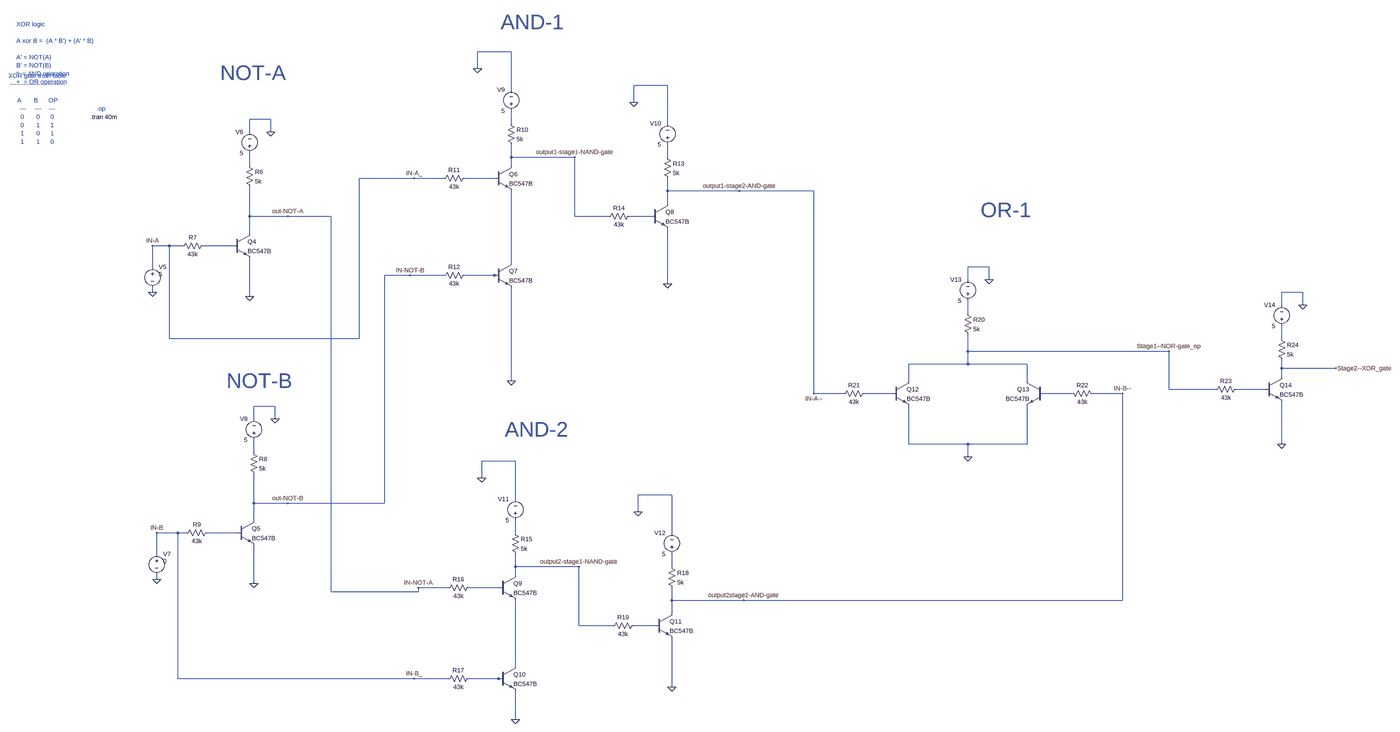
[diagram p0: schematic BJT_as_XOR_gate.asc, whole sheet]
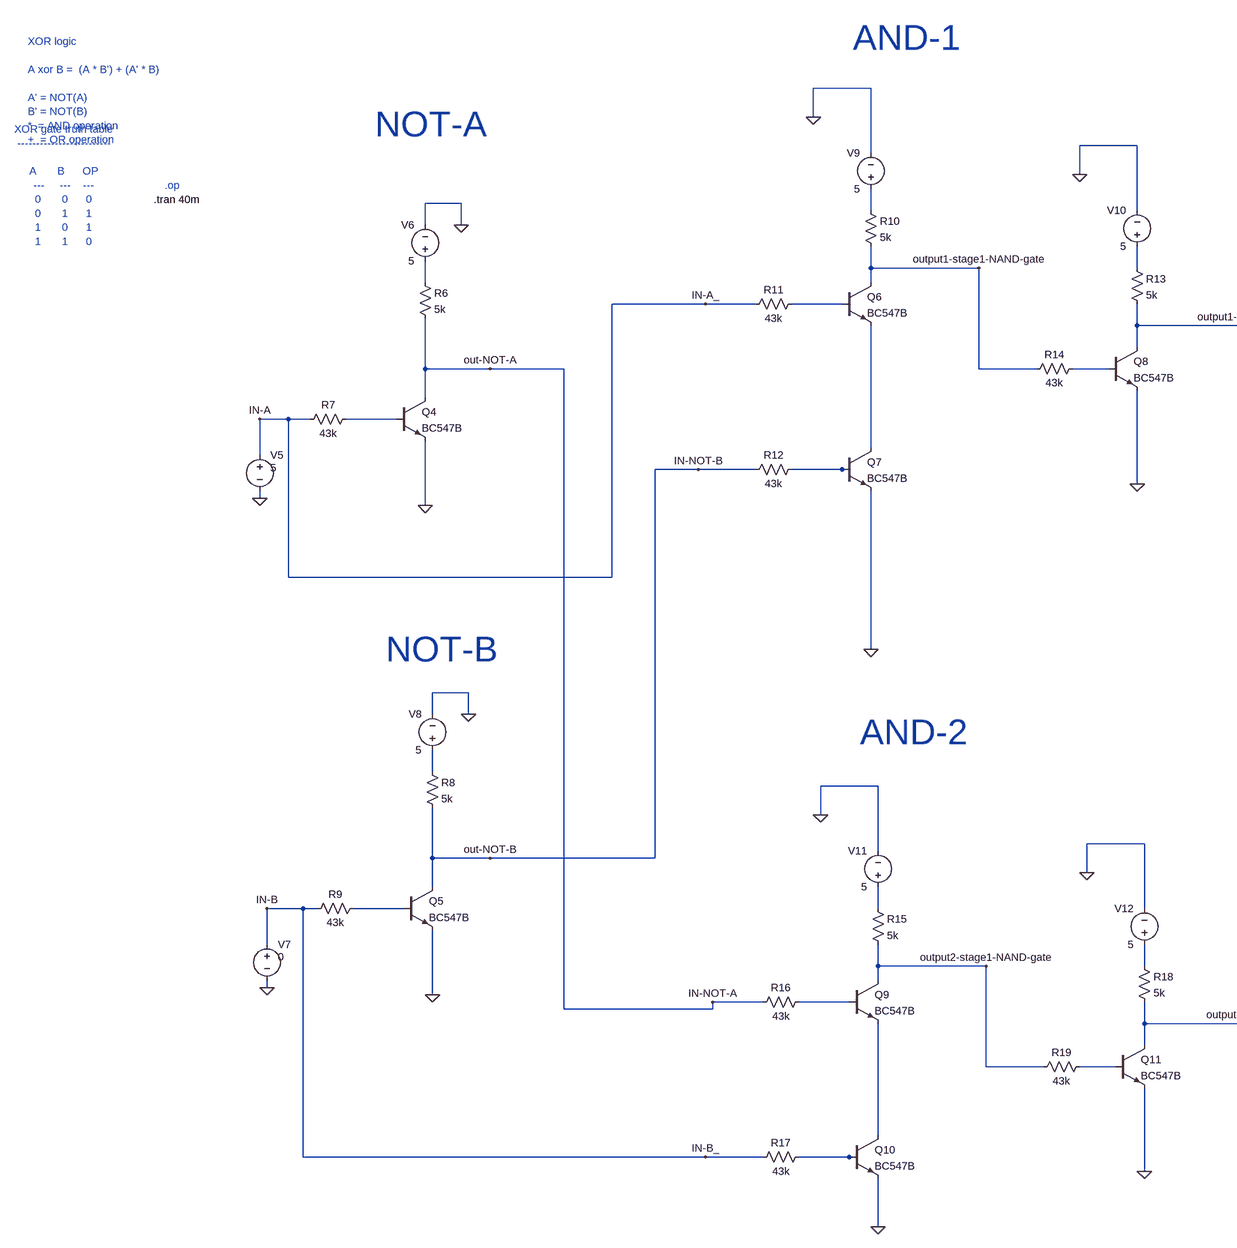
[diagram p1: schematic BJT_as_XOR_gate.asc, part, row 1 of 1, column 1 of 2]
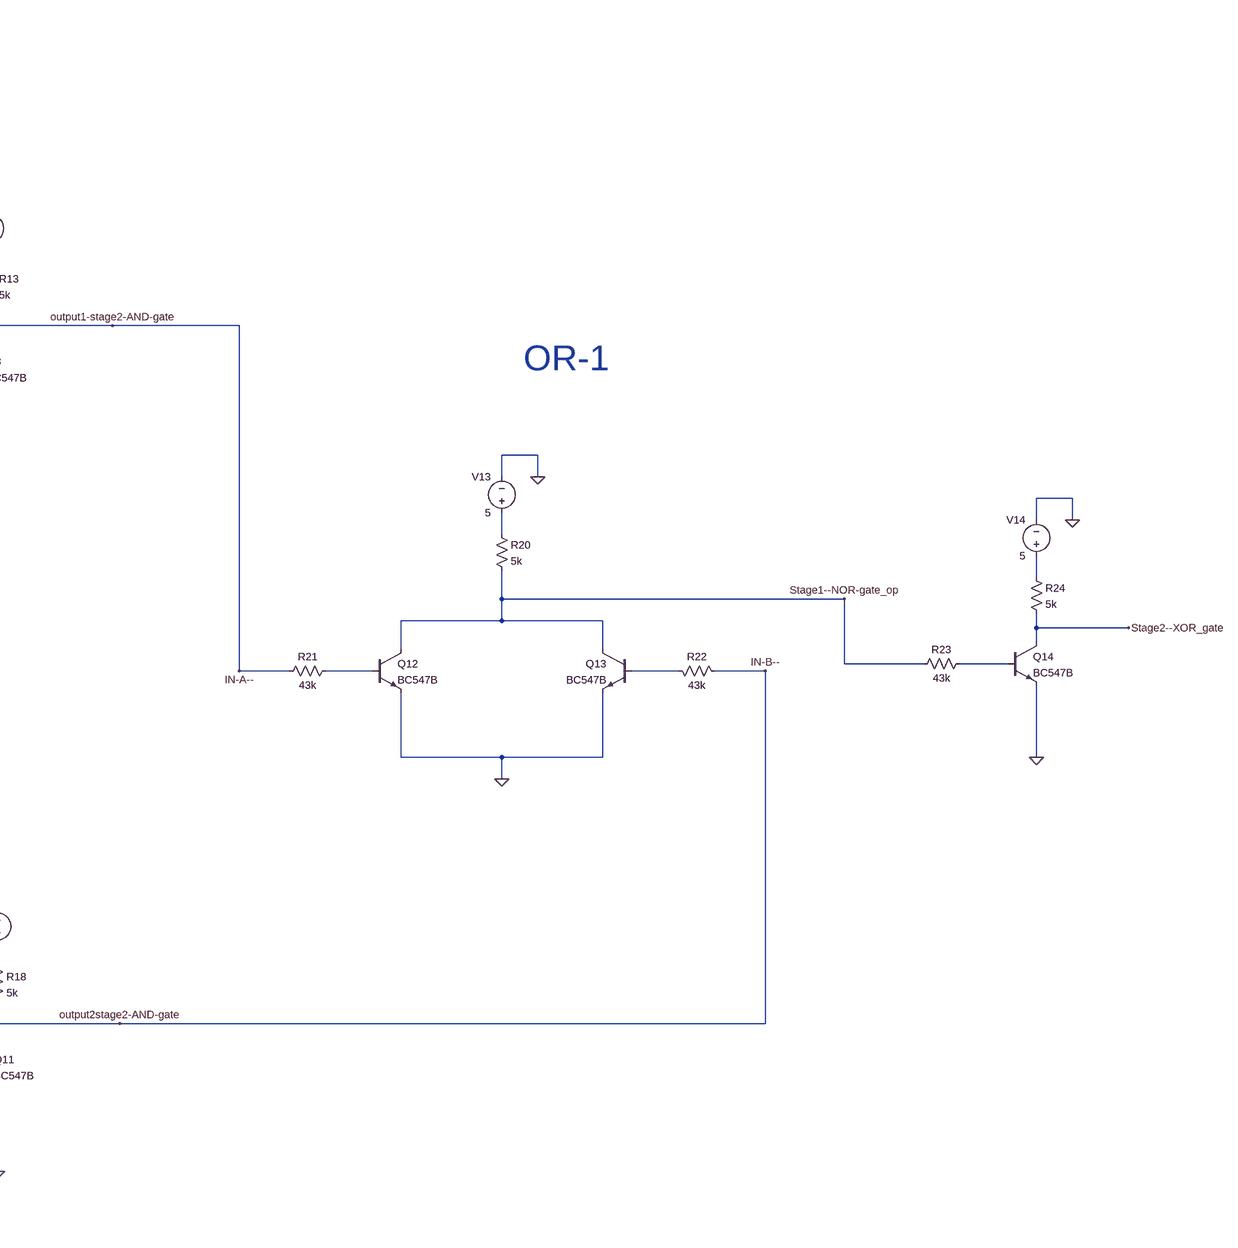
[diagram p2: schematic BJT_as_XOR_gate.asc, part, row 1 of 1, column 2 of 2]
BJT_as_XOR_gate.asc, the LTspice schematic file:
Version 4.1
SHEET 1 2536 1052
WIRE -1856 -3168 -1984 -3168
WIRE -1984 -3104 -1984 -3168
WIRE -1264 -3040 -1392 -3040
WIRE -1856 -3024 -1856 -3168
WIRE -1392 -2976 -1392 -3040
WIRE -3120 -2912 -3200 -2912
WIRE -1856 -2896 -1856 -2944
WIRE -1264 -2896 -1264 -3040
WIRE -3200 -2864 -3200 -2912
WIRE -3120 -2864 -3120 -2912
WIRE -1856 -2768 -1856 -2816
WIRE -1616 -2768 -1856 -2768
WIRE -1264 -2768 -1264 -2816
WIRE -3200 -2736 -3200 -2784
WIRE -1856 -2736 -1856 -2768
WIRE -2224 -2688 -2432 -2688
WIRE -2112 -2688 -2224 -2688
WIRE -1920 -2688 -2032 -2688
WIRE -1264 -2640 -1264 -2688
WIRE -992 -2640 -1264 -2640
WIRE -352 -2640 -992 -2640
WIRE -1264 -2592 -1264 -2640
WIRE -3200 -2544 -3200 -2656
WIRE -3056 -2544 -3200 -2544
WIRE -2592 -2544 -3056 -2544
WIRE -1616 -2544 -1616 -2768
WIRE -1488 -2544 -1616 -2544
WIRE -1328 -2544 -1408 -2544
WIRE -3200 -2480 -3200 -2544
WIRE -3504 -2432 -3568 -2432
WIRE -3456 -2432 -3504 -2432
WIRE -3264 -2432 -3376 -2432
WIRE -1856 -2368 -1856 -2640
WIRE -3568 -2352 -3568 -2432
WIRE 320 -2352 240 -2352
WIRE -2240 -2320 -2336 -2320
WIRE -2112 -2320 -2240 -2320
WIRE -1920 -2320 -2032 -2320
WIRE -1904 -2320 -1920 -2320
WIRE 240 -2304 240 -2352
WIRE 320 -2304 320 -2352
WIRE -1264 -2288 -1264 -2496
WIRE -3568 -2256 -3568 -2272
WIRE 1520 -2256 1440 -2256
WIRE -3200 -2240 -3200 -2384
WIRE 1440 -2208 1440 -2256
WIRE 1520 -2208 1520 -2256
WIRE 240 -2176 240 -2224
WIRE -3504 -2080 -3504 -2432
WIRE -2432 -2080 -2432 -2688
WIRE -2432 -2080 -3504 -2080
WIRE 1440 -2080 1440 -2128
WIRE 240 -2032 240 -2096
WIRE 1008 -2032 240 -2032
WIRE 240 -1984 240 -2032
WIRE 240 -1984 16 -1984
WIRE 464 -1984 240 -1984
WIRE 1440 -1968 1440 -2000
WIRE 1776 -1968 1440 -1968
WIRE 1440 -1936 1440 -1968
WIRE -1856 -1920 -1856 -2272
WIRE 16 -1920 16 -1984
WIRE 464 -1920 464 -1984
WIRE 1008 -1888 1008 -2032
WIRE 1184 -1888 1008 -1888
WIRE 1376 -1888 1264 -1888
WIRE -352 -1872 -352 -2640
WIRE -240 -1872 -352 -1872
WIRE -48 -1872 -160 -1872
WIRE 640 -1872 528 -1872
WIRE 832 -1872 720 -1872
WIRE -3104 -1824 -3184 -1824
WIRE -3184 -1776 -3184 -1824
WIRE -3104 -1776 -3104 -1824
WIRE 16 -1680 16 -1824
WIRE 240 -1680 16 -1680
WIRE 464 -1680 464 -1824
WIRE 464 -1680 240 -1680
WIRE 1440 -1680 1440 -1840
WIRE -3184 -1648 -3184 -1696
WIRE 240 -1632 240 -1680
WIRE -1840 -1616 -1968 -1616
WIRE -1968 -1552 -1968 -1616
WIRE -1248 -1488 -1376 -1488
WIRE -1840 -1472 -1840 -1616
WIRE -3184 -1456 -3184 -1568
WIRE -3056 -1456 -3184 -1456
WIRE -2336 -1456 -2336 -2320
WIRE -2336 -1456 -3056 -1456
WIRE -1376 -1424 -1376 -1488
WIRE -3184 -1392 -3184 -1456
WIRE -3472 -1344 -3552 -1344
WIRE -3440 -1344 -3472 -1344
WIRE -3248 -1344 -3360 -1344
WIRE -1840 -1344 -1840 -1392
WIRE -1248 -1344 -1248 -1488
WIRE -3552 -1264 -3552 -1344
WIRE -1840 -1216 -1840 -1264
WIRE -1600 -1216 -1840 -1216
WIRE -1248 -1216 -1248 -1264
WIRE -1840 -1184 -1840 -1216
WIRE -3552 -1168 -3552 -1184
WIRE -3184 -1152 -3184 -1296
WIRE -2096 -1136 -2208 -1136
WIRE -1904 -1136 -2016 -1136
WIRE -2592 -1120 -2592 -2544
WIRE -2208 -1120 -2208 -1136
WIRE -2208 -1120 -2592 -1120
WIRE -1248 -1088 -1248 -1136
WIRE -976 -1088 -1248 -1088
WIRE 832 -1088 832 -1872
WIRE 832 -1088 -976 -1088
WIRE -1248 -1040 -1248 -1088
WIRE -1600 -992 -1600 -1216
WIRE -1472 -992 -1600 -992
WIRE -1312 -992 -1392 -992
WIRE -1840 -816 -1840 -1088
WIRE -3472 -768 -3472 -1344
WIRE -2224 -768 -3472 -768
WIRE -2096 -768 -2224 -768
WIRE -1904 -768 -2016 -768
WIRE -1888 -768 -1904 -768
WIRE -1248 -736 -1248 -944
WIRE -1840 -368 -1840 -720
FLAG -3568 -2432 IN-A
FLAG -3568 -2256 0
FLAG -3120 -2864 0
FLAG -3200 -2240 0
FLAG -3552 -1344 IN-B
FLAG -3552 -1168 0
FLAG -3104 -1776 0
FLAG -3184 -1152 0
FLAG -3056 -2544 out-NOT-A
FLAG -3056 -1456 out-NOT-B
FLAG -2224 -2688 IN-A_
FLAG -2240 -2320 IN-NOT-B
FLAG -1856 -1920 0
FLAG -1984 -3104 0
FLAG -1392 -2976 0
FLAG -1264 -2288 0
FLAG -1616 -2768 output1-stage1-NAND-gate
FLAG -992 -2640 output1-stage2-AND-gate
FLAG -2208 -1136 IN-NOT-A
FLAG -2224 -768 IN-B_
FLAG -1840 -368 0
FLAG -1968 -1552 0
FLAG -1376 -1424 0
FLAG -1248 -736 0
FLAG -1600 -1216 output2-stage1-NAND-gate
FLAG -976 -1088 output2stage2-AND-gate
FLAG -352 -1872 IN-A--
FLAG 832 -1872 IN-B--
FLAG 240 -1632 0
FLAG 320 -2304 0
FLAG 1008 -2032 Stage1--NOR-gate_op
FLAG 1520 -2208 0
FLAG 1440 -1680 0
FLAG 1776 -1968 Stage2--XOR_gate
SYMBOL voltage -3568 -2368 R0
WINDOW 3 24 44 Left 2
WINDOW 123 0 0 Left 0
WINDOW 39 0 0 Left 0
SYMATTR Value 5
SYMATTR InstName V5
SYMBOL npn -3264 -2480 R0
SYMATTR InstName Q4
SYMATTR Value BC547B
SYMBOL voltage -3200 -2768 R180
WINDOW 0 24 96 Left 2
WINDOW 3 24 16 Left 2
WINDOW 123 0 0 Left 0
WINDOW 39 0 0 Left 0
SYMATTR InstName V6
SYMATTR Value 5
SYMBOL res -3216 -2752 R0
SYMATTR InstName R6
SYMATTR Value 5k
SYMBOL res -3360 -2448 R90
WINDOW 0 0 56 VBottom 2
WINDOW 3 32 56 VTop 2
SYMATTR InstName R7
SYMATTR Value 43k
SYMBOL voltage -3552 -1280 R0
WINDOW 3 24 44 Left 2
WINDOW 123 0 0 Left 0
WINDOW 39 0 0 Left 0
SYMATTR Value 0
SYMATTR InstName V7
SYMBOL npn -3248 -1392 R0
SYMATTR InstName Q5
SYMATTR Value BC547B
SYMBOL voltage -3184 -1680 R180
WINDOW 0 24 96 Left 2
WINDOW 3 24 16 Left 2
WINDOW 123 0 0 Left 0
WINDOW 39 0 0 Left 0
SYMATTR InstName V8
SYMATTR Value 5
SYMBOL res -3200 -1664 R0
SYMATTR InstName R8
SYMATTR Value 5k
SYMBOL res -3344 -1360 R90
WINDOW 0 0 56 VBottom 2
WINDOW 3 32 56 VTop 2
SYMATTR InstName R9
SYMATTR Value 43k
SYMBOL npn -1920 -2736 R0
SYMATTR InstName Q6
SYMATTR Value BC547B
SYMBOL voltage -1856 -2928 R180
WINDOW 0 24 96 Left 2
WINDOW 3 24 16 Left 2
WINDOW 123 0 0 Left 0
WINDOW 39 0 0 Left 0
SYMATTR InstName V9
SYMATTR Value 5
SYMBOL res -1872 -2912 R0
SYMATTR InstName R10
SYMATTR Value 5k
SYMBOL res -2016 -2704 R90
WINDOW 0 0 56 VBottom 2
WINDOW 3 32 56 VTop 2
SYMATTR InstName R11
SYMATTR Value 43k
SYMBOL npn -1920 -2368 R0
SYMATTR InstName Q7
SYMATTR Value BC547B
SYMBOL res -2016 -2336 R90
WINDOW 0 0 56 VBottom 2
WINDOW 3 32 56 VTop 2
SYMATTR InstName R12
SYMATTR Value 43k
SYMBOL npn -1328 -2592 R0
SYMATTR InstName Q8
SYMATTR Value BC547B
SYMBOL voltage -1264 -2800 R180
WINDOW 0 24 96 Left 2
WINDOW 3 24 16 Left 2
WINDOW 123 0 0 Left 0
WINDOW 39 0 0 Left 0
SYMATTR InstName V10
SYMATTR Value 5
SYMBOL res -1280 -2784 R0
SYMATTR InstName R13
SYMATTR Value 5k
SYMBOL res -1392 -2560 R90
WINDOW 0 0 56 VBottom 2
WINDOW 3 32 56 VTop 2
SYMATTR InstName R14
SYMATTR Value 43k
SYMBOL npn -1904 -1184 R0
SYMATTR InstName Q9
SYMATTR Value BC547B
SYMBOL voltage -1840 -1376 R180
WINDOW 0 24 96 Left 2
WINDOW 3 24 16 Left 2
WINDOW 123 0 0 Left 0
WINDOW 39 0 0 Left 0
SYMATTR InstName V11
SYMATTR Value 5
SYMBOL res -1856 -1360 R0
SYMATTR InstName R15
SYMATTR Value 5k
SYMBOL res -2000 -1152 R90
WINDOW 0 0 56 VBottom 2
WINDOW 3 32 56 VTop 2
SYMATTR InstName R16
SYMATTR Value 43k
SYMBOL npn -1904 -816 R0
SYMATTR InstName Q10
SYMATTR Value BC547B
SYMBOL res -2000 -784 R90
WINDOW 0 0 56 VBottom 2
WINDOW 3 32 56 VTop 2
SYMATTR InstName R17
SYMATTR Value 43k
SYMBOL npn -1312 -1040 R0
SYMATTR InstName Q11
SYMATTR Value BC547B
SYMBOL voltage -1248 -1248 R180
WINDOW 0 24 96 Left 2
WINDOW 3 24 16 Left 2
WINDOW 123 0 0 Left 0
WINDOW 39 0 0 Left 0
SYMATTR InstName V12
SYMATTR Value 5
SYMBOL res -1264 -1232 R0
SYMATTR InstName R18
SYMATTR Value 5k
SYMBOL res -1376 -1008 R90
WINDOW 0 0 56 VBottom 2
WINDOW 3 32 56 VTop 2
SYMATTR InstName R19
SYMATTR Value 43k
SYMBOL npn -48 -1920 R0
SYMATTR InstName Q12
SYMATTR Value BC547B
SYMBOL voltage 240 -2208 R180
WINDOW 0 24 96 Left 2
WINDOW 3 24 16 Left 2
WINDOW 123 0 0 Left 0
WINDOW 39 0 0 Left 0
SYMATTR InstName V13
SYMATTR Value 5
SYMBOL res 224 -2192 R0
SYMATTR InstName R20
SYMATTR Value 5k
SYMBOL res -144 -1888 R90
WINDOW 0 0 56 VBottom 2
WINDOW 3 32 56 VTop 2
SYMATTR InstName R21
SYMATTR Value 43k
SYMBOL npn 528 -1920 M0
SYMATTR InstName Q13
SYMATTR Value BC547B
SYMBOL res 624 -1888 M90
WINDOW 0 0 56 VBottom 2
WINDOW 3 32 56 VTop 2
SYMATTR InstName R22
SYMATTR Value 43k
SYMBOL npn 1376 -1936 R0
SYMATTR InstName Q14
SYMATTR Value BC547B
SYMBOL res 1280 -1904 R90
WINDOW 0 0 56 VBottom 2
WINDOW 3 32 56 VTop 2
SYMATTR InstName R23
SYMATTR Value 43k
SYMBOL voltage 1440 -2112 R180
WINDOW 0 24 96 Left 2
WINDOW 3 24 16 Left 2
WINDOW 123 0 0 Left 0
WINDOW 39 0 0 Left 0
SYMATTR InstName V14
SYMATTR Value 5
SYMBOL res 1424 -2096 R0
SYMATTR InstName R24
SYMATTR Value 5k
TEXT -4200 -2920 Left 2 !.tran 40m
TEXT -4176 -2952 Left 2 ;.op
TEXT -4400 -2952 Center 2 ;XOR gate truth table\n-------------------------\n \nA       B      OP\n---     ---    ---\n0       0      0\n0       1      1\n1       0      1\n1       1      0
TEXT -4480 -3272 Left 2 ;XOR logic\n \nA xor B =  (A * B') + (A' * B) \n \nA' = NOT(A)\nB' = NOT(B)\n*  = AND operation\n+  = OR operation
TEXT -1896 -3280 Left 6 ;AND-1
TEXT -1880 -1736 Left 6 ;AND-2
TEXT -3312 -3088 Left 6 ;NOT-A
TEXT -3288 -1920 Left 6 ;NOT-B
TEXT 288 -2568 Left 6 ;OR-1

The netlist it stands for:
* BJT_as_XOR_gate.asc
V5 IN-A_ 0 5
Q4 IN-NOT-A N006 0 0 BC547B
V6 N003 0 5
R6 N003 IN-NOT-A 5k
R7 N006 IN-A_ 43k
V7 IN-B_ 0 0
Q5 IN-NOT-B N015 0 0 BC547B
V8 N014 0 5
R8 N014 IN-NOT-B 5k
R9 N015 IN-B_ 43k
Q6 output1-stage1-NAND-gate N004 N007 0 BC547B
V9 N001 0 5
R10 N001 output1-stage1-NAND-gate 5k
R11 N004 IN-A_ 43k
Q7 N007 N008 0 0 BC547B
R12 N008 IN-NOT-B 43k
Q8 IN-A-- N005 0 0 BC547B
V10 N002 0 5
R13 N002 IN-A-- 5k
R14 N005 output1-stage1-NAND-gate 43k
Q9 output2-stage1-NAND-gate N018 N020 0 BC547B
V11 N016 0 5
R15 N016 output2-stage1-NAND-gate 5k
R16 N018 IN-NOT-A 43k
Q10 N020 N021 0 0 BC547B
R17 N021 IN-B_ 43k
Q11 IN-B-- N019 0 0 BC547B
V12 N017 0 5
R18 N017 IN-B-- 5k
R19 N019 output2-stage1-NAND-gate 43k
Q12 Stage1--NOR-gate_op N012 0 0 BC547B
V13 N009 0 5
R20 N009 Stage1--NOR-gate_op 5k
R21 N012 IN-A-- 43k
Q13 Stage1--NOR-gate_op N013 0 0 BC547B
R22 N013 IN-B-- 43k
Q14 Stage2--XOR_gate N011 0 0 BC547B
R23 N011 Stage1--NOR-gate_op 43k
V14 N010 0 5
R24 N010 Stage2--XOR_gate 5k
.model NPN NPN
.model PNP PNP
.lib standard.bjt
.tran 40m
* .op
* XOR gate truth table
* -------------------------
* A       B      OP
* ---     ---    ---
* 0       0      0
* 0       1      1
* 1       0      1
* 1       1      0
* XOR logic
* A xor B =  (A * B') + (A' * B)
* A' = NOT(A)
* B' = NOT(B)
* *  = AND operation
* +  = OR operation
* AND-1
* AND-2
* NOT-A
* NOT-B
* OR-1
.backanno
.end